# Altium schematic sheet scheme-mkii.SchDoc: AVRISP MKII mini
size A3; CheckedBy: Andrew Danich; Author: Andrew Danich; DrawnBy: Andrew Danich; Engineer: Andrew Danich; Organization: Andrew Danich; DocumentNumber: 1; Revision: 1; SheetNumber: 1; SheetTotal: 1; ProjectName: AVRISP MKII mini
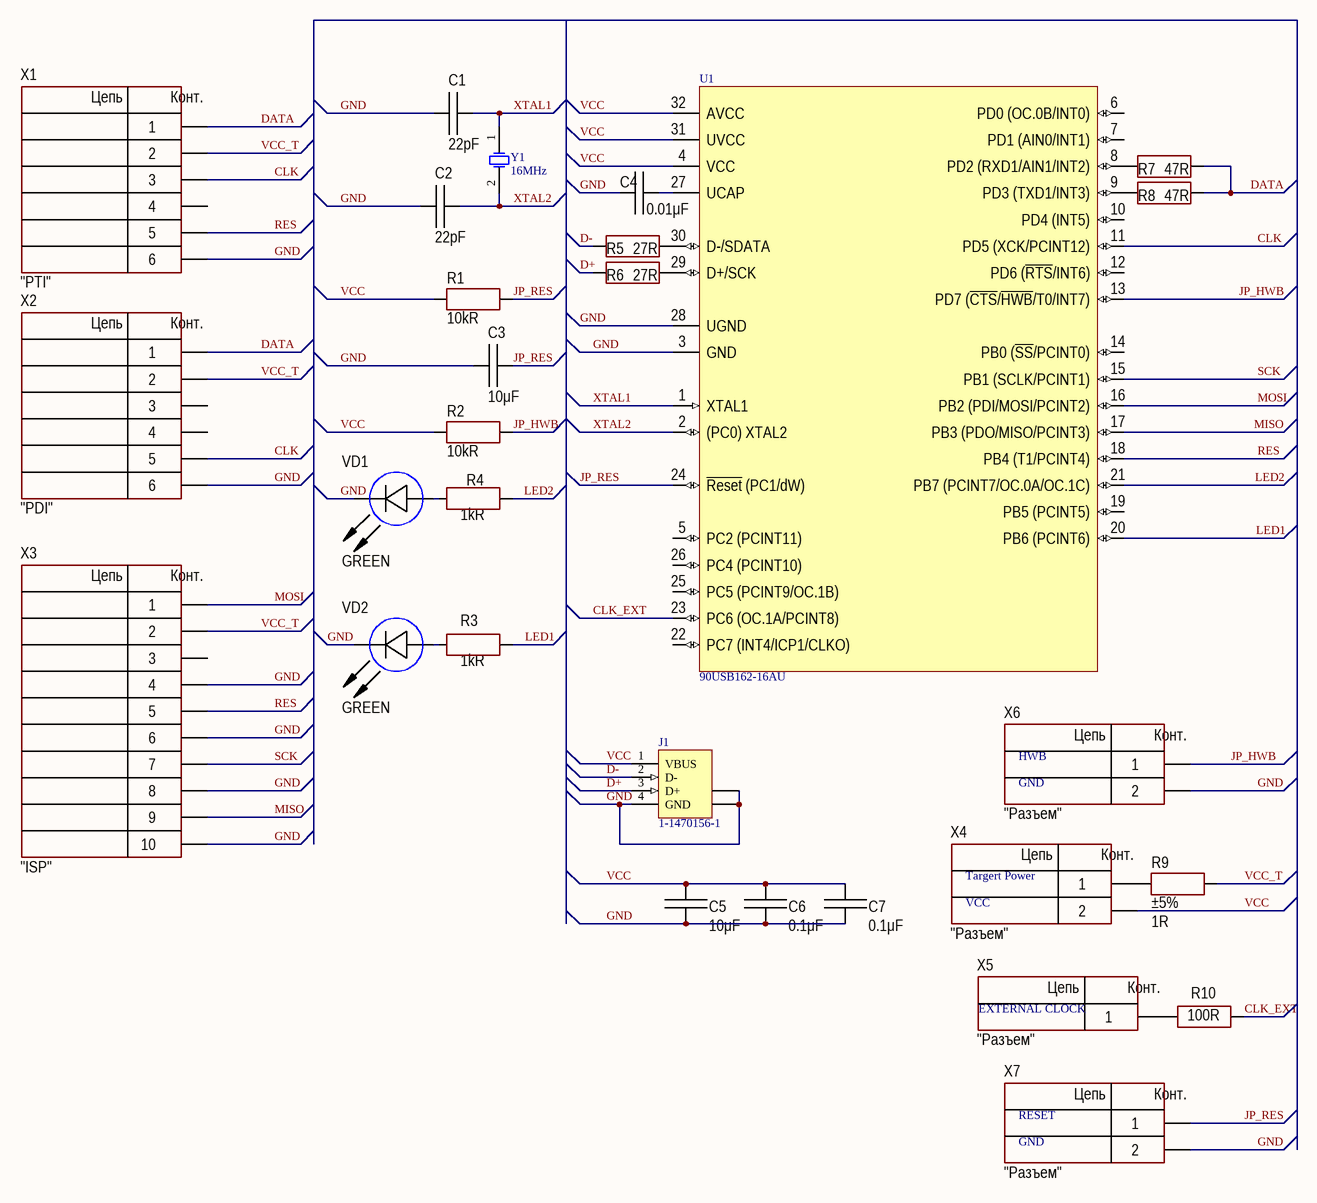
[diagram p0: scheme-mkii.SchDoc]

## Parts
C1  value 22pF  [CAP: 0805]
C2  value 22pF  [CAP: 0805]
C3  value 10μF  [CAP: 0805]
C4  value 0.01μF  [CAP: 0805]
C5  value 10μF  [CAP: 0805]
C6  value 0.1μF  [CAP: 0805]
C7  value 0.1μF  [CAP: 0805]
J1  1-1470156-1  [1-1470156]
R1  value 10kR  [RES: 0402]
R2  value 10kR  [RES: 0402]
R3  value 1kR  [RES: 0402]
R4  value 1kR  [RES: 0402]
R5  value 27R  [RES: 0402]
R6  value 27R  [RES: 0402]
R7  value 47R  [RES: 0402]
R8  value 47R  [RES: 0402]
R9  value 1R  Tolerance: ±5%  [RES: 0402]
R10  value 100R  [RES: 0402]
U1  90USB162-16AU  [32MA_N]
VD1  Color: GREEN  [LED: 0402B]
VD2  Color: GREEN  [LED: 0402B]
X1  CommentText: "PTI"  [CON: IDC-6MS]
X2  CommentText: "PDI"  [CON: IDC-6MS]
X3  CommentText: "ISP"  [CON: IDC-10MS]
X4  CommentText: "Разъем"  CommentText: Targert Power  CommentText: VCC  [CON: PLS-2]
X5  CommentText: "Разъем"  [CON: PLS-1]
X6  CommentText: "Разъем"  CommentText: HWB  CommentText: GND  [CON: PLS-2]
X7  CommentText: "Разъем"  CommentText: RESET  CommentText: GND  [CON: PLS-2]
Y1  16MHz  [HC-49U]

## Nets
CLK: U1.11(PD5_(XCK/PCINT12)) X1.3 X2.5
CLK_EXT: R10.2 U1.23(PC6_(OC.1A/PCINT8))
D+: J1.3(D+) R6.1
D-: J1.2(D-) R5.1
DATA: R7.2 R8.2 X1.1 X2.1
GND: C1.1 C2.1 C3.1 C4.2 C5.2 C6.2 C7.2 J1.4(GND) J1.5(SHLD) J1.6(SHLD) U1.3(GND) U1.28(UGND) VD1.2(C) VD2.2(C) X1.6 X2.6 X3.4 X3.6 X3.8 X3.10 X6.2 X7.2
JP_HWB: R2.1 U1.13(PD7_(~{CTS}/~{HWB}/T0/INT7)) X6.1
JP_RES: C3.2 R1.1 U1.24(~{Reset}_(PC1/dW)) X7.1
LED1: R3.2 U1.20(PB6_(PCINT6))
LED2: R4.2 U1.21(PB7_(PCINT7/OC.0A/OC.1C))
MISO: U1.17(PB3_(PDO/MISO/PCINT3)) X3.9
MOSI: U1.16(PB2_(PDI/MOSI/PCINT2)) X3.1
RES: U1.18(PB4_(T1/PCINT4)) X1.5 X3.5
SCK: U1.15(PB1_(SCLK/PCINT1)) X3.7
VCC: C5.1 C6.1 C7.1 J1.1(VBUS) R1.2 R2.2 U1.4(VCC) U1.31(UVCC) U1.32(AVCC) X4.2
VCC_T: R9.2 X1.2 X2.2 X3.2
XTAL1: C1.2 U1.1(XTAL1) Y1.1(OSC1)
XTAL2: C2.2 U1.2((PC0)_XTAL2) Y1.2(OSC2)
NetC4_1: C4.1 U1.27(UCAP)
NetR3_1: R3.1 VD2.1(A)
NetR4_1: R4.1 VD1.1(A)
NetR5_2: R5.2 U1.30(D-/SDATA)
NetR6_2: R6.2 U1.29(D+/SCK)
NetR7_1: R7.1 U1.8(PD2_(RXD1/AIN1/INT2))
NetR8_1: R8.1 U1.9(PD3_(TXD1/INT3))
NetR9_1: R9.1 X4.1
NetR10_1: R10.1 X5.1

Not connected (* = marked no-connect by the designer): U1 5(PC2_(PCINT11)) 6(PD0_(OC.0B/INT0)) 7(PD1_(AIN0/INT1)) 10(PD4_(INT5)) 12(PD6_(~{RTS}/INT6)) 14(PB0_(~{SS}/PCINT0)) 19(PB5_(PCINT5)) 22(PC7_(INT4/ICP1/CLKO)) 25(PC5_(PCINT9/OC.1B)) 26(PC4_(PCINT10)); X1 4; X2 3 4; X3 3

## Notes on the sheet
- Title
- Size:
- Date:
- A4
- Number:
- Time:
- Revision:
- Sheet
- of
- File:
- (in symbol IDC-6) Цепь; Конт.
- (in symbol IDC-10) Цепь; Конт.
- (in symbol PLS-1) Цепь; Конт.; EXTERNAL CLOCK
- (in symbol PLS-2) Цепь; Конт.

## Library data of the parts
C1 C2 = Ceramic_0805: Manufacturer: Yageo; PartNumber: CC0805KRX7R7BB104; ValueManufacturerPartNumber: Ceramic capacitor, 22pF, X7R, ±10%, 16V, 0805, -55...+125°C; TypeCapacitor: Ceramic capacitor; Tolerance: ±10%; TypeDielectric: X7R; Voltage: 16V; Package: 0805; HelpURL: https://www.digikey.com/product-detail/en/yageo/CC0805KRX7R7BB104/311-1142-1-ND/303052; Temperature: -55...+125°C
C3 C5 = Ceramic_0805: Manufacturer: Yageo; PartNumber: CC0805KRX7R7BB104; ValueManufacturerPartNumber: Ceramic capacitor, 10μF, X7R, ±10%, 16V, 0805, -55...+125°C; TypeCapacitor: Ceramic capacitor; Tolerance: ±10%; TypeDielectric: X7R; Voltage: 16V; Package: 0805; HelpURL: https://www.digikey.com/product-detail/en/yageo/CC0805KRX7R7BB104/311-1142-1-ND/303052; Temperature: -55...+125°C
C4 = Ceramic_0805: Manufacturer: Yageo; PartNumber: CC0805KRX7R7BB104; ValueManufacturerPartNumber: Ceramic capacitor, 0.01μF, X7R, ±10%, 16V, 0805, -55...+125°C; TypeCapacitor: Ceramic capacitor; Tolerance: ±10%; TypeDielectric: X7R; Voltage: 16V; Package: 0805; HelpURL: https://www.digikey.com/product-detail/en/yageo/CC0805KRX7R7BB104/311-1142-1-ND/303052; Temperature: -55...+125°C
C6 C7 = Ceramic_0805: Manufacturer: Yageo; PartNumber: CC0805KRX7R7BB104; ValueManufacturerPartNumber: Ceramic capacitor, 0.1μF, X7R, ±10%, 16V, 0805, -55...+125°C; TypeCapacitor: Ceramic capacitor; Tolerance: ±10%; TypeDielectric: X7R; Voltage: 16V; Package: 0805; HelpURL: https://www.digikey.com/product-detail/en/yageo/CC0805KRX7R7BB104/311-1142-1-ND/303052; Temperature: -55...+125°C
J1 = 1-1470156-1: USB 1.1, Right Angle, Thru-Hole, B Type, Receptacle, 4 Position, White; ContactMaterial: Phosphor Bronze; ContactPlating: Gold over Nickel; TerminationLength: 3.00mm [0.118in.]; PCB_Layout: Complies with manufacturer's recommendation.; DrillSize: Corresponds to nominal value.; PanelGround: Without; Published: 15-Jul-2004; DatasheetDocument: 02-Jun-2001; PackageDocument: 02-Jun-2001; PackageReference: 1-1470156; Publisher: Altium Limited; HousingMaterial: Glass-Filled Thermoplastic; ComponentLink1Description: Manufacturer Link; ComponentLink1URL: http://www.tycoelectronics.com/; ComponentLink2Description: Packaging Specification; ComponentLink2URL: http://ecommas.tycoelectronics.com/commerce/DocumentDelivery/DDEController?Action=showdoc&DocId=Customer+Drawing%7F1470156%7FO%7Ftif%7FEnglish%7FC_1470156_O.tif
R1 R2 = Resistor_0402: Manufacturer: Yageo; PartNumber: RC0402JR-07100RL; ValueManufacturerPartNumber: Resistor film, 10kR, ±5%, 0402, 0.063W, -55...+125°C; TypeResistor: Resistor film; Power: 0.063W; Tolerance: ±5%; Package: 0402; HelpURL: https://www.digikey.com/product-detail/en/yageo/RC0402JR-07100RL/311-100JRCT-ND/729362; Temperature: -55...+125°C
R3 R4 = Resistor_0402: Manufacturer: Yageo; PartNumber: RC0402JR-07100RL; ValueManufacturerPartNumber: Resistor film, 1kR, ±5%, 0402, 0.063W, -55...+125°C; TypeResistor: Resistor film; Power: 0.063W; Tolerance: ±5%; Package: 0402; HelpURL: https://www.digikey.com/product-detail/en/yageo/RC0402JR-07100RL/311-100JRCT-ND/729362; Temperature: -55...+125°C
R5 R6 = Resistor_0402: Manufacturer: Yageo; PartNumber: RC0402JR-07100RL; ValueManufacturerPartNumber: Resistor film, 27R, ±5%, 0402, 0.063W, -55...+125°C; TypeResistor: Resistor film; Power: 0.063W; Tolerance: ±5%; Package: 0402; HelpURL: https://www.digikey.com/product-detail/en/yageo/RC0402JR-07100RL/311-100JRCT-ND/729362; Temperature: -55...+125°C
R7 R8 = Resistor_0402: Manufacturer: Yageo; PartNumber: RC0402JR-07100RL; ValueManufacturerPartNumber: Resistor film, 47R, ±5%, 0402, 0.063W, -55...+125°C; TypeResistor: Resistor film; Power: 0.063W; Tolerance: ±5%; Package: 0402; HelpURL: https://www.digikey.com/product-detail/en/yageo/RC0402JR-07100RL/311-100JRCT-ND/729362; Temperature: -55...+125°C
R9 = Resistor_0402: Manufacturer: Yageo; PartNumber: RC0402JR-07100RL; ValueManufacturerPartNumber: Resistor film, 1R, ±5%, 0402, 0.063W, -55...+125°C; TypeResistor: Resistor film; Power: 0.063W; Package: 0402; HelpURL: https://www.digikey.com/product-detail/en/yageo/RC0402JR-07100RL/311-100JRCT-ND/729362; Temperature: -55...+125°C
R10 = Resistor_0402: Manufacturer: Yageo; PartNumber: RC0402JR-07100RL; ValueManufacturerPartNumber: Resistor film, 100R, ±5%, 0402, 0.063W, -55...+125°C; TypeResistor: Resistor film; Power: 0.063W; Tolerance: ±5%; Package: 0402; HelpURL: https://www.digikey.com/product-detail/en/yageo/RC0402JR-07100RL/311-100JRCT-ND/729362; Temperature: -55...+125°C
U1 = 90USB162-16AU: 8-bit AVR Microcontroller, 2.7-5.5V, 16KB Flash, 512 Bytes EEPROM, 512 Bytes SRAM, USB Controller, 32-pin TQFP, Industrial Grade (-40°C to 85°C); DatasheetVersion: revF, Nov-2010; PackageVersion: revB, Jul-2007; PackageReference: 32MA; PackageDescription: 32-Lead Thin Profile Plastic Quad Flatpack (TQFP) - 7x7x1mm Body,  0.8 mm Pitch; ComponentLink1Description: Manufacturer URL; ComponentLink1URL: http://www.atmel.com/; ComponentLink2Description: AT90USB82/162 Datasheet; ComponentLink2URL: http://www.atmel.com/dyn/resources/prod_documents/doc7707.pdf
VD1 VD2 = LED_single: ValueManufacturerPartNumber: LED, *, *, *, -55...+150°C; TypeDiode: LED; Manufacturer: *; Package: *; HelpURL: *; Temperature: -55...+150°C; Current: *; VoltageDrop: *; PartNumber: *
X1 X2 = IDC-6: Manufacturer: Connfly; ValueManufacturerPartNumber: Connector, 6pin, 2.54mm, 250VAC, 3A; TypeConnector: Connector; VoltageMax: 250VAC; Pitch: 2.54mm; CurrentMax: 3A; Multichannel: 6pin; HelpURL: https://ru.aliexpress.com/item/1719644716.html?spm=a2g0v.search0104.3.23.4d9c1bc6xlIt6Q&ws_ab_test=searchweb0_0%2Csearchweb201602_10_10065_10068_319_317_10696_453_10084_454_10083_10618_10307_10301_537_536_10059_10884_10887_321_322_10915_10103_10914_10911_10910%2Csearchweb201603_52%2CppcSwitch_0&algo_expid=18a75006-9775-490c-9b34-8e5eba9edd8d-3&algo_pvid=18a75006-9775-490c-9b34-8e5eba9edd8d&transAbTest=ae803_5; PartNumber: IDC-6
X3 = IDC-10: Manufacturer: Connfly; ValueManufacturerPartNumber: Connector, 10pin, 2.54mm, 250VAC, 3A; TypeConnector: Connector; VoltageMax: 250VAC; Pitch: 2.54mm; CurrentMax: 3A; Multichannel: 10pin; HelpURL: https://www.chipdip.ru/product/idc-10ms; PartNumber: IDC-10
X4 X6 X7 = PLS-2: Manufacturer: Connfly; ValueManufacturerPartNumber: Connector, 2pin, 2.54mm, 500VAC, 3A; TypeConnector: Connector; VoltageMax: 500VAC; Pitch: 2.54mm; CurrentMax: 3A; Multichannel: 2pin; HelpURL: https://www.chipdip.ru/product/pls-2; PartNumber: PLS-2
X5 = PLS-1: Manufacturer: Connfly; ValueManufacturerPartNumber: Connector, 2pin, 2.54mm, 500VAC, 3A; TypeConnector: Connector; VoltageMax: 500VAC; Pitch: 2.54mm; CurrentMax: 3A; Multichannel: 2pin; HelpURL: https://www.chipdip.ru/product/pls-2; PartNumber: PLS-1
Y1 = ECS-10-13-1: Crystal Oscillator; Published: 17-Jul-2002; DatasheetDocument: 18-Apr-2000; PackageReference: HC-49U; Publisher: Altium Limited; ComponentLink1Description: Manufacturer Link; ComponentLink1URL: http://www.ecsxtal.com/; ComponentLink2Description: Datasheet; ComponentLink2URL: http://www.ecsxtal.com/pdf2/HC49U.PDF